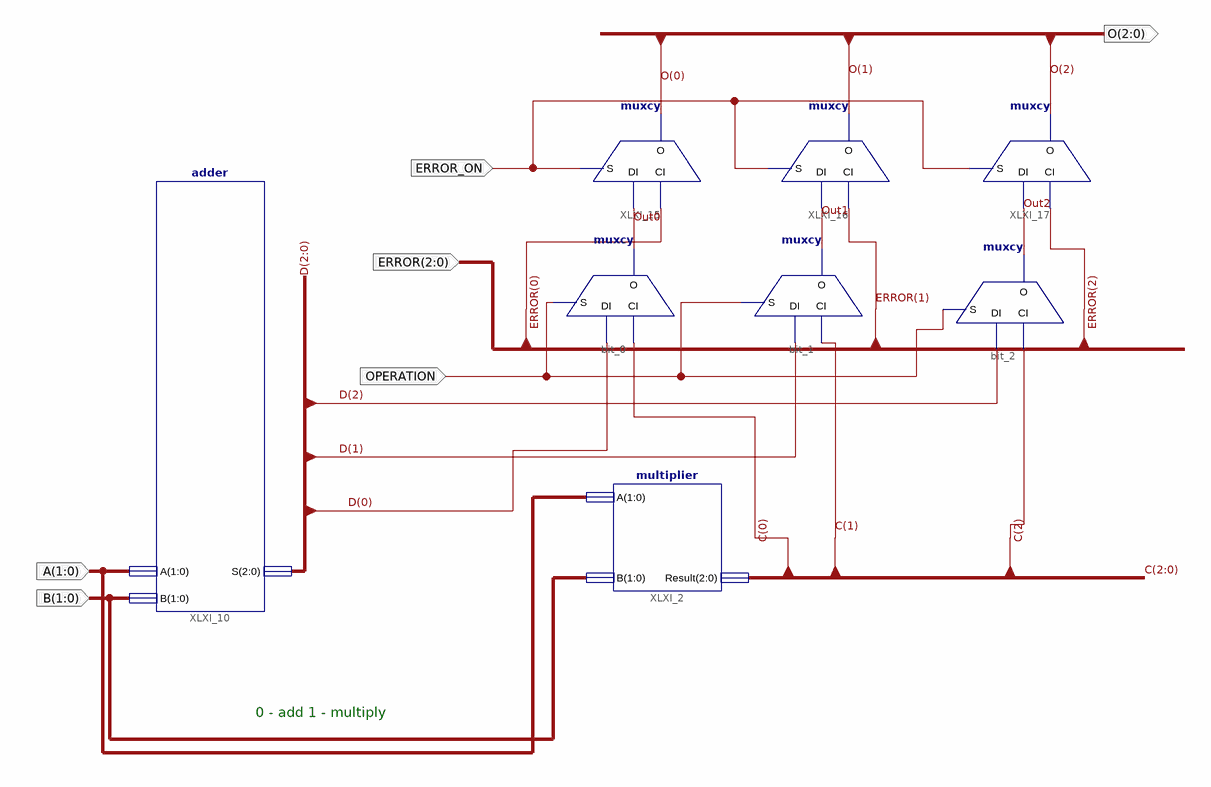
[diagram p0: schematic sheet 1]
// Xilinx ISE schematic arthmetic_unit.sch (spartan3e) as structural Verilog: 8 symbols, 6 ports
module arthmetic_unit (
  input  [1:0] A,
  input  [1:0] B,
  input  OPERATION,
  input  ERROR_ON,
  input  [2:0] ERROR,
  output [2:0] O
);

  wire Out0, Out1, Out2;
  wire [2:0] C, D;

  multiplier XLXI_2 (.A(A), .B(B), .Result(C));
  muxcy bit_0 (.CI(C[0]), .DI(D[0]), .S(OPERATION), .O(Out0));
  muxcy bit_1 (.CI(C[1]), .DI(D[1]), .S(OPERATION), .O(Out1));
  muxcy bit_2 (.CI(C[2]), .DI(D[2]), .S(OPERATION), .O(Out2));
  adder XLXI_10 (.B(B), .A(A), .S(D));
  muxcy XLXI_15 (.CI(ERROR[0]), .DI(Out0), .S(ERROR_ON), .O(O[0]));
  muxcy XLXI_16 (.CI(ERROR[1]), .DI(Out1), .S(ERROR_ON), .O(O[1]));
  muxcy XLXI_17 (.CI(ERROR[2]), .DI(Out2), .S(ERROR_ON), .O(O[2]));

  // Notes on the sheet:
  //   0 - add 1 - multiply
endmodule
